# EAGLE design M_D_ext_power_old (EAGLE 9.6.2)
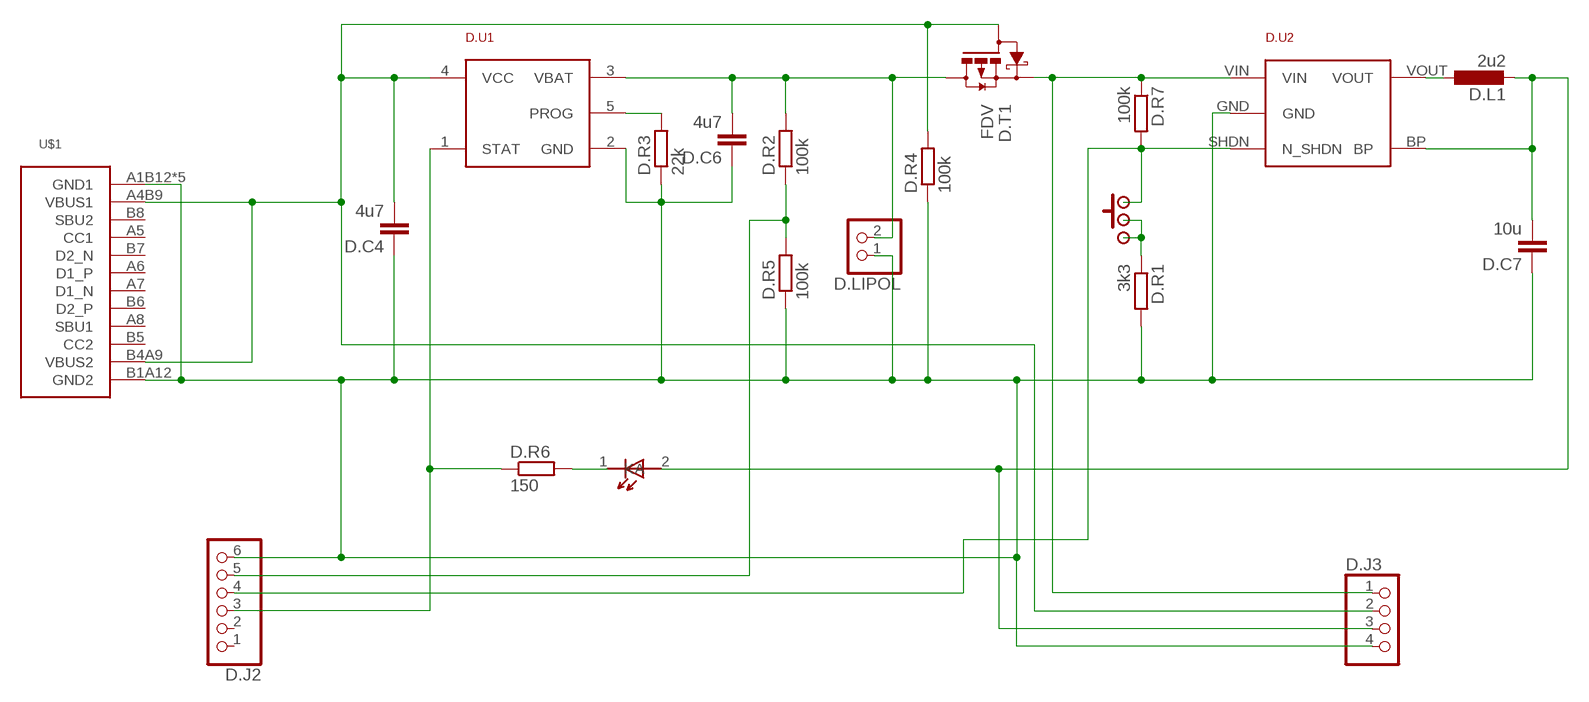
[diagram p0: schematic, sheet 1]

## Parts
D.C4  4u7  C-EUC0603  [C0603]
D.C6  4u7  C-EUC0603  [C0603]
D.C7  10u  C-EUC0603  [C0603]
D.D1  LED_1.8  [LED_1.8]
D.J2  PINHD-1X6  [1X06]
D.J3  PINHD-1X4  [1X04]
D.L1  2u2  L-EUL3230M  [L3230M]
D.LIPOL  PINHD-1X2  [1X02]
D.ON/OFF/RESET  SWITCH  [SWITCH]
D.R1  3k3  R-EU_R0603  [R0603]
D.R2  100k  R-EU_R0603  [R0603]
D.R3  22k  R-EU_R0603  [R0603]
D.R4  100k  R-EU_R0603  [R0603]
D.R5  100k  R-EU_R0603  [R0603]
D.R6  150  R-EU_R0603  [R0603]
D.R7  100k  R-EU_R0603  [R0603]
D.T1  FDV  P-MOSFET-FDV304P  [SOT23]
D.U1  MCP  MCP73831  [SOT23-5]
D.U2  TC  STABILISER_APE8865  [SOT32-5]
U$1  USB-C  [USB-C]

## Nets
GND: D.C4.1 D.C6.1 D.C7.1 D.J2.6 D.J3.4 D.LIPOL.1 D.R1.2 D.R3.1 D.R4.1 D.R5.1 D.U1.2(GND) D.U2.GND U$1.A1B12(GND1) U$1.B1A12(GND2) U$1.SH1(GND1) U$1.SH2(GND1) U$1.SH3(GND1) U$1.SH4(GND1)
N$1: D.ON/OFF/RESET.P$2 D.ON/OFF/RESET.P$3 D.ON/OFF/RESET.P$5 D.R1.1
N$2: D.L1.1 D.U2.VOUT
N$3: D.D1.1(K) D.R6.2
N$5: D.J2.5 D.R2.1 D.R5.2
N$8: D.C6.2 D.LIPOL.2 D.R2.2 D.T1.D D.U1.3(VBAT)
N$9: D.C4.2 D.J3.2 D.R4.2 D.T1.G D.U1.4(VCC) U$1.A4B9(VBUS1) U$1.B4A9(VBUS2)
N$11: D.R3.2 D.U1.5(PROG)
N$12: D.J3.1 D.R7.1 D.T1.S D.U2.VIN
N$20: D.J2.4 D.ON/OFF/RESET.P$1 D.ON/OFF/RESET.P$4 D.R7.2 D.U2.SHDN(N_SHDN)
PA7: D.J2.3 D.R6.1 D.U1.1(STAT)
VDD: D.C7.2 D.D1.2(A) D.J3.3 D.L1.2 D.U2.BP
Unconnected: D.J2.1 D.J2.2 U$1.A5(CC1) U$1.A6(D1_P) U$1.A7(D1_N) U$1.A8(SBU1) U$1.B5(CC2) U$1.B6(D2_P) U$1.B7(D2_N) U$1.B8(SBU2)

## Library data of the parts
D.C4 D.C6 D.C7 = rcl:C-EU: CAPACITOR, European symbol; SPICEPREFIX: C
D.D1 = hugo:LED_1.8
D.J2 = pinhead2:PINHD-1X6: PIN HEADER
D.J3 = pinhead2:PINHD-1X4: PIN HEADER
D.L1 = rcl:L-EU: INDUCTOR, European symbol; SPICEPREFIX: L
D.LIPOL = pinhead2:PINHD-1X2: PIN HEADER
D.ON/OFF/RESET = hugo:SWITCH
D.R1-D.R7 = rcl:R-EU_: RESISTOR, European symbol; SPICEPREFIX: R
D.T1 = !stavebnice03:P-MOSFET-FDV304P
D.U1 = !stavebnice03:MCP73831
D.U2 = !stavebnice03:STABILISER_APE8865
U$1 = hugo:USB-C

## Board
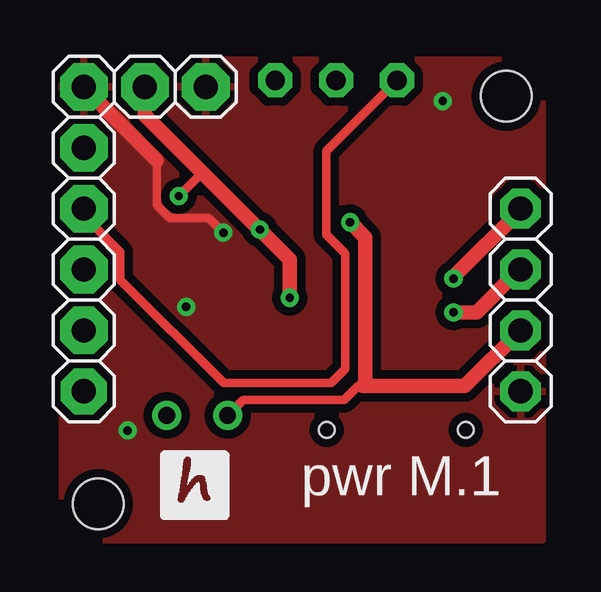
[diagram p1: board, top side]
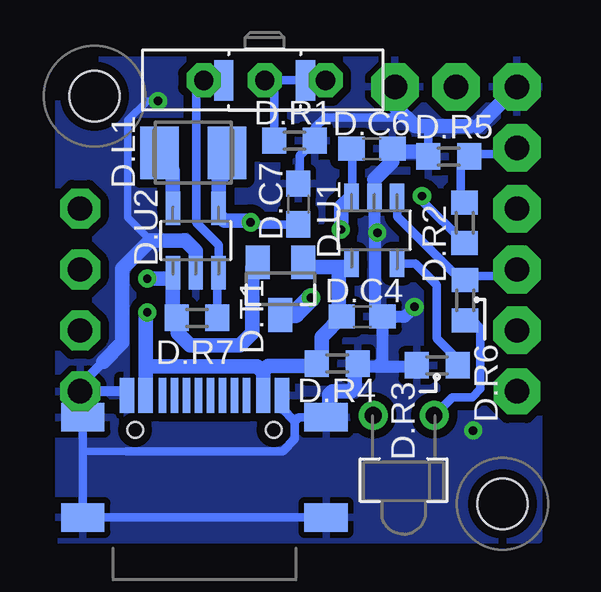
[diagram p2: board, bottom side, seen from below]

No outline drawn. Coordinates in mm, seen from the top.
Copper layers (1*16): Top 0.035mm / dielectric 1.5mm / Bottom 0.035mm
Design rules "default *": minimum track width 10mil, minimum drill 0.35mm, track to track 6mil, track to pad 6mil, pad to pad 6mil, via to via 10mil, smd to smd 10mil, copper to edge 15mil, drill to drill 15mil, minimum pad ring 10mil, minimum via ring 8mil, stop-mask expansion 4mil, vias tented up to drill 0mil, thermal gap 10mil
Holes 2.1 mm at 2,2 19,19

### Footprints (pad centres in the part's own frame; a part is rotated, then mirrored left to right if it is on the bottom)
C0603 = smd 1.1 x 1: 1 -0.85,0; 2 0.85,0
LED_1.8 = drill 0.7: 1 -1.27,-0.4; 2 1.27,-0.4
1X06 = drill 1.016 pad 1.93 octagon: 1 -6.35,0 | drill 1.016 pad 1.981 octagon: 2 -3.81,0; 3 -1.27,0; 4 1.27,0; 5 3.81,0; 6 6.35,0
1X04 = drill 1.016 pad 1.676 octagon: 1 -3.81,0; 2 -1.27,0; 3 1.27,0; 4 3.81,0
L3230M = smd 1.6 x 2.2: 1 -1.4,0; 2 1.4,0
1X02 = drill 1.016 pad 1.981 octagon: 1 -1.27,0; 2 1.27,0
SWITCH = drill 0.8 pad 1.422 octagon: P$1 -2.54,0; P$2 0,0; P$3 2.54,0 | smd 0.8 x 1.7: P$4 -1.7,0; P$5 1.7,0
R0603 = smd 1 x 1.1: 1 -0.85,0; 2 0.85,0
SOT23 = smd 1 x 1.4: D 0,1.1; G -0.95,-1.1; S 0.95,-1.1
SOT23-5 = smd 0.6 x 1.1: 1 -0.95,-1.45; 2 0,-1.45; 3 0.95,-1.45; 4 0.95,1.35; 5 -0.95,1.35
SOT32-5 = smd 0.6 x 1.4: BP 0.95,1.35; GND 0,-1.35; SHDN 0.95,-1.35; VIN -0.95,-1.35; VOUT -0.95,1.35
USB-C = smd 0.6 x 1.45: A1B12 -3.235,3.825; A4B9 -2.46,3.825; B1A12 3.215,3.825; B4A9 2.44,3.825 | smd 0.3 x 1.45: A5 -1.26,3.825; A6 -0.26,3.825; A7 0.24,3.825; A8 1.24,3.825; B5 1.74,3.825; B6 0.74,3.825; B7 -0.76,3.825; B8 -1.76,3.825 | smd 1.8 x 1.2: SH1 -5.08,2.91; SH2 -5.08,-1.27; SH3 5.06,-1.27; SH4 5.06,2.91 | hole 0.65: 2.88,2.38; -2.9,2.38

### Placement (x,y rotation side)
D.C4  7.85,9.8 180 bottom
D.C6  7.44,16.81 180 bottom
D.C7  10.52,14.5 270 bottom
D.D1  6.12,5.28 180 bottom
D.J2  1.4,13.04 90 top
D.J3  19.6,10.5 270 top
D.L1  14.88,16.64 0 bottom
D.LIPOL  5.21,19.39 180 top
D.ON/OFF/RESET  11.91,19.66 0 bottom
D.R1  10.67,17.14 0 bottom
D.R2  3.58,13.72 270 bottom
D.R3  4.72,7.77 0 bottom
D.R4  8.89,7.85 180 bottom
D.R5  4.24,16.48 0 bottom
D.R6  3.56,10.49 270 bottom
D.R7  14.73,9.75 0 bottom
D.T1  11.25,10.97 180 bottom
D.U1  7.34,13.36 180 bottom
D.U2  14.78,12.98 0 bottom
U$1  14.41,2.7 0 bottom

### Tracks (layer width: path | path; a pad name or v marks a point on that pad's centre or on a via)
GND  (via drill 0.35)
  Top 0.356: 4.45,16.3 4.45,14.46 4.98,13.92 6.6,13.92 v7.21,13.31
  Top 0.61: D.J2.6 4.45,16.3
  Bottom 0.305: 17.68,4.2 19.49,4.2 19.49,4.19 | 16.68,12.99 17.62,13.94 17.62,17.99 16.81,18.8 v16.36,18.8
  Bottom 0.356: D.C7.1 10.45,15.35 10.45,16.51 D.R1.2 9.82,17.68 9.39,18.11 6.58,18.11 6.48,18.21 D.LIPOL.1 | 5.51,7.77 D.R3.1 5.62,7.72 | 5.29,16.69 D.R5.1 5.09,17.56 4.91,17.75 | U$1.SH3 U$1.SH2 19.49,4.19 U$1.SH1 | 10.65,5.45 10.65,4.71 11.16,4.2 17.68,4.2 | 10.65,5.45 11.2,6 U$1.B1A12 | 10.65,5.45 10.48,5.61 U$1.SH4 | 8.17,7.72 D.R4.1
  Bottom 0.406: 18.64,7.92 19.6,6.96 | D.J3.4 19.59,6.7 17.82,6.7 U$1.A1B12
  Bottom 0.508: D.C4.1 7,10.01 | D.U1.2 7.34,13.49 7.21,13.36 v7.21,13.31 7.32,13.21 7.32,10.12 D.C4.1 | D.C4.1 7,10.03 | D.C4.1 7,7.98 7.18,7.8 | D.R4.1 7.91,7.72 5.62,7.72 | D.C4.1 6.07,9.8 v5.66,10.21
  Bottom 0.559: D.U1.2 7.34,15.52
  Bottom 0.61: D.LIPOL.1 6.48,18.59 5.64,17.75 4.91,17.75 3.36,17.75 | 3.03,17.72 D.J2.6 | 7.34,15.52 6.59,16.27 D.C6.1 6.46,16.69 5.29,16.69 | D.U2.GND 14.78,12.55 15.22,12.99 16.68,12.99 17.84,11.82 17.84,8.73 18.64,7.92 | 8.81,5.84 9.12,5.84 U$1.SH4 9.22,5.74 9.22,6.55 9.09,6.68 8.31,6.68 8.17,6.82 8.17,7.72 8.08,7.63 | 19.6,6.96 D.J3.4 19.6,5.72 U$1.SH1
  other vias: 3.23,5.05
  pour Top (isolate 0.356): 0.5,20.5 0.5,0.5 20.5,0.5 20.5,20.5
  pour Bottom (isolate 0.356): 0.5,20.5 20.5,20.5 20.5,0.5 0.5,0.5
N$1
  Bottom 0.356: D.ON/OFF/RESET.P$3 D.ON/OFF/RESET.P$5 D.ON/OFF/RESET.P$2 11.52,19.27 D.R1.1
N$2
  Bottom 0.61: D.U2.VOUT 15.73,15.9 16.28,16.46 D.L1.1
N$3
  Bottom 0.356: 3.3,9.39 D.R6.2 3.23,9.64 2.92,9.34 2.92,6.78 3.26,6.45 4.09,6.45 D.D1.1
N$5
  Bottom 0.356: D.J2.5 1.64,16.59 3.29,16.59 D.R5.2 3.75,16.13 3.75,14.73 D.R2.1
N$8  (via drill 0.35)
  Top 0.356: v5.36,14.83 6.33,15.81
  Top 0.61: v9.98,10.59 9.98,12.19 v8.74,13.44 8.71,13.44 6.33,15.81 3.94,18.2 D.LIPOL.2
  Bottom 0.356: 8.32,14.81 D.U1.3 8.26,14.85 8.26,16.78 D.C6.2 | D.R2.2 5.36,14.64 v5.36,14.83
  Bottom 0.508: 8.71,13.46 v8.74,13.44
  Bottom 0.61: D.U1.3 8.71,14.39 8.71,13.46
  Bottom 0.813: D.T1.D 11.19,9.93 10.64,9.93 v9.98,10.59
N$9  (via drill 0.35)
  Top 0.61: v16.8,9.98 17.77,9.98 19.32,11.54 19.37,11.54 D.J3.2
  Bottom 0.508: 11.95,6.51 11.95,7.52 11.95,7.55
  Bottom 0.61: D.U1.4 8.29,11.93 8.34,11.88 8.83,11.88 8.83,11.87 | D.C4.2 8.83,9.93 8.83,11.87 | D.T1.G 10.3,11.87 8.83,11.87 | D.C4.2 8.72,9.78 | D.C4.2 9.54,8.97 9.54,8.05 D.R4.2 9.84,7.75 11.75,7.75 11.95,7.55 | v16.8,9.98 16.86,9.93 16.86,7.64 | U$1.B4A9 11.97,7.48 | 11.97,7.48 12.23,7.73 16.77,7.73 16.86,7.64 | U$1.A4B9 16.87,7.63 16.86,7.64 | 11.95,7.52 11.97,7.5 11.97,7.48
N$11
  Bottom 0.356: D.U1.5 5.63,12.01 4.75,11.12 4.75,8.9 3.87,8.03 D.R3.2
N$12  (via drill 0.35)
  Top 0.61: D.J3.1 19.6,14.26 16.8,11.46 v16.8,11.39
  Bottom 0.356: 15.97,11.39 D.U2.VIN
  Bottom 0.61: D.U2.VIN 15.73,9.9 D.R7.1 15.53,9.7 15.53,9.13 15.01,8.61 12.95,8.61 12.43,9.13 12.43,11.84 D.T1.S | v16.8,11.39 15.97,11.39
N$20
  Top 0.356: D.ON/OFF/RESET.P$1 11.51,16.72 11.51,13.22 12.29,12.44 12.29,7.62 11.71,7.04 7.22,7.04 2.92,11.34 2.92,12.5 1.4,14.02 D.J2.4
  Bottom 0.356: D.R7.2 13.88,11.58 D.U2.SHDN 13.83,12.79 14.77,13.72 14.77,19.34 D.ON/OFF/RESET.P$1 D.ON/OFF/RESET.P$4
PA7
  Bottom 0.356: 6.39,15.1 D.U1.1 6.39,13.98 4.03,11.62 3.56,11.62 3.56,11.49 | 3.56,11.49 D.R6.1 | 3.56,11.49 1.6,11.49 D.J2.3
VDD  (via drill 0.35)
  Top 0.356: 13.13,6.91 13.02,6.91 12.84,6.91 12.26,6.33 8.04,6.33 D.D1.2
  Top 0.61: v12.5,13.74 13.13,13.1 13.13,6.91 | D.J3.3 17.28,6.91 13.02,6.91
  Bottom 0.356: 13.08,16.25 13.35,15.98 13.48,15.98 | D.C7.2 12.5,13.65 v12.5,13.74
  Bottom 0.61: D.L1.2 13.48,15.98 | 13.35,15.98 13.83,15.5 D.U2.BP 13.83,14.05 13.6,13.82 12.57,13.82 v12.5,13.74

### Text on the board
tPlace: pwr M.1